# Altium schematic sheet BAT.SchDoc
size A
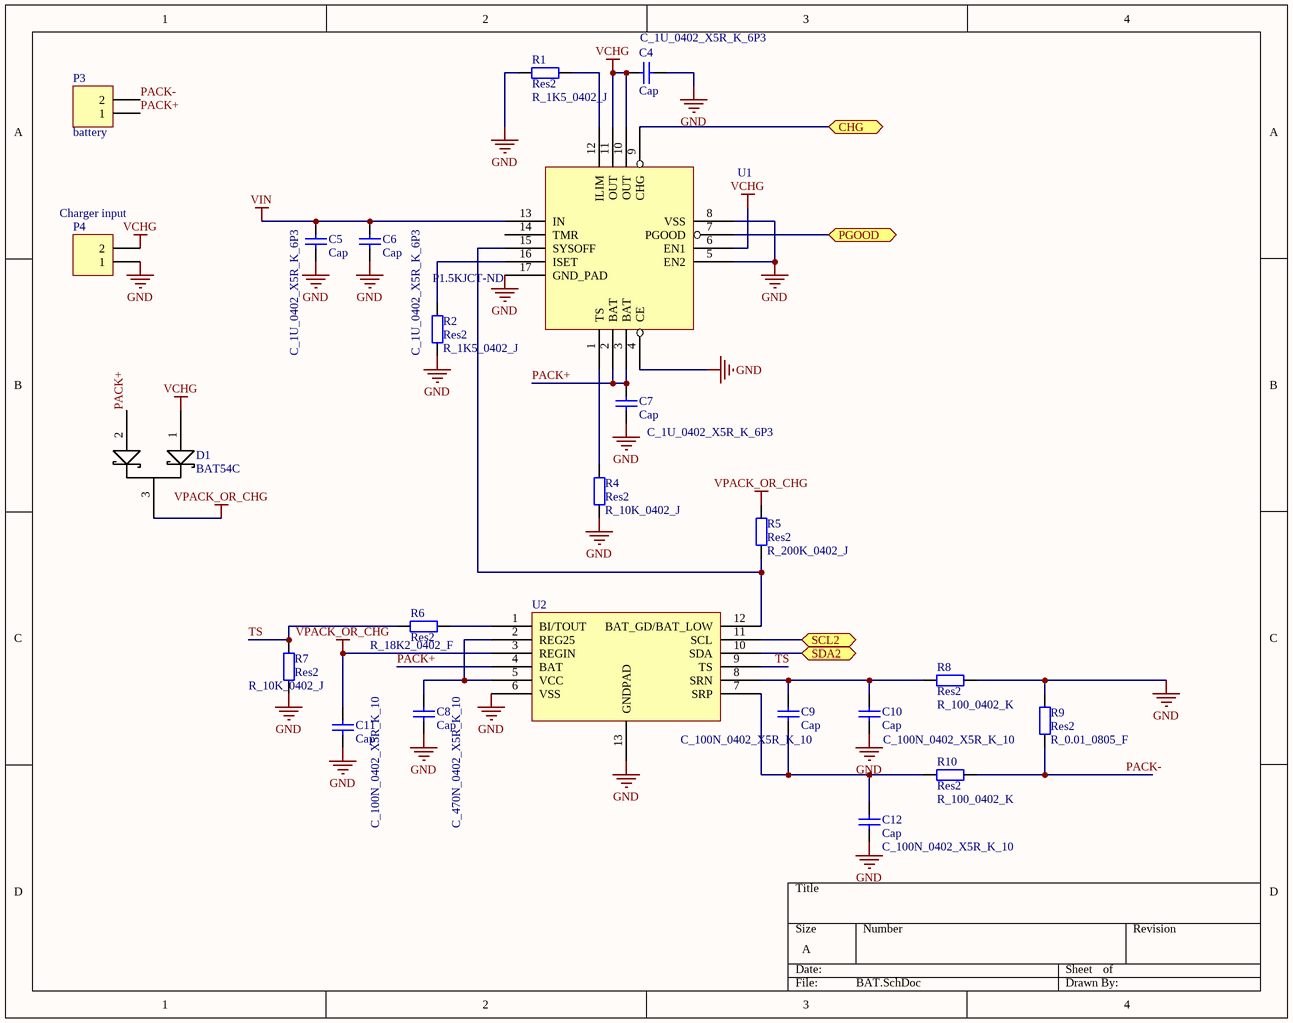
[diagram p0: BAT.SchDoc]

## Parts
C4  Cap  value C_1U_0402_X5R_K_6P3  [C_0402]
C5  Cap  value C_1U_0402_X5R_K_6P3  [C_0402]
C6  Cap  value C_1U_0402_X5R_K_6P3  [C_0402]
C7  Cap  value C_1U_0402_X5R_K_6P3  [C_0402]
C8  Cap  value C_470N_0402_X5R_K_10  [C_0402]
C9  Cap  value C_100N_0402_X5R_K_10  [C_0402]
C10  Cap  value C_100N_0402_X5R_K_10  [C_0402]
C11  Cap  value C_100N_0402_X5R_K_10  [C_0402]
C12  Cap  value C_100N_0402_X5R_K_10  [C_0402]
D1  BAT54C  [SOT-23_N]
P3  battery  [PL-041939]
P4  Charger input  [HDR1X2]
R1  Res2  value R_1K5_0402_J  [R_0402]
R2  Res2  value R_1K5_0402_J  Supplier Part Number 1: P1.5KJCT-ND  [R_0402]
R4  Res2  value R_10K_0402_J  [R_0402]
R5  Res2  value R_200K_0402_J  [R_0402]
R6  Res2  value R_18K2_0402_F  [R_0402]
R7  Res2  value R_10K_0402_J  [R_0402]
R8  Res2  value R_100_0402_K  [R_0402]
R9  Res2  value R_0.01_0805_F  [R_0805]
R10  Res2  value R_100_0402_K  [R_0402]
U1  BQ24079TRGTR  [S-PVQFN-N16]  (value not drawn)
U2  BQ27510DRZR-G2  [S-PDSO-N12]  (value not drawn)

## Ports
CHG, PGOOD, SCL2, SDA2

## Nets
GND: C4.1 C5.1 C6.1 C7.1 C8.1 C10.1 C11.1 C12.1 P4.1 R1.1 R2.2 R4.1 R7.1 R8.2 R9.2 U1.4(CE) U1.5(EN2) U1.8(VSS) U1.17(GND_PAD) U2.6(VSS) U2.13(GNDPAD)
VCHG: C4.2 D1.1 P4.2 U1.6(EN1) U1.10(OUT) U1.11(OUT)
VIN: C5.2 C6.2 U1.13(IN)
VPACK_OR_CHG: C11.2 D1.3 R5.1 U2.3(REGIN)
CHG: U1.9(CHG) ; port CHG
PACK+: C7.2 D1.2 P3.1 U1.2(BAT) U1.3(BAT) U2.4(BAT)
PACK-: P3.2 R9.1 R10.2
PGOOD: U1.7(PGOOD) ; port PGOOD
SCL2: U2.11(SCL) ; port SCL2
SDA2: U2.10(SDA) ; port SDA2
TS: R6.1 R7.2 U2.9(TS)
NetC8_2: C8.2 U2.2(REG25) U2.5(VCC)
NetC9_1: C9.1 C12.2 R10.1 U2.7(SRP)
NetC9_2: C9.2 C10.2 R8.1 U2.8(SRN)
NetR1_2: R1.2 U1.12(ILIM)
NetR2_1: R2.1 U1.16(ISET)
NetR4_2: R4.2 U1.1(TS)
NetR5_2: R5.2 U1.15(SYSOFF) U2.12(BAT_GD/BAT_LOW)
NetR6_2: R6.2 U2.1(BI/TOUT)

Not connected (* = marked no-connect by the designer): U1 14(TMR)

## Library data of the parts
C4-C12 = Cap: Capacitor; Published: 8-Jun-2000; LatestRevisionDate: 17-Jul-2002; LatestRevisionNote: Re-released for DXP Platform.; Publisher: Altium Limited; Supplier 1: Digi-Key; Supplier 2: Mouser
  C4-C7: Supplier Part Number 1: 490-1320-1-ND; Supplier Part Number 2: 81-GRM155R60J105KE19
  C8: Supplier Part Number 1: 490-3264-1-ND; Supplier Part Number 2: 81-GRM155R61A474KE5D
  C9-C12: Supplier Part Number 1: 490-1318-6-ND; Supplier Part Number 2: 81-GRM155R61A104KA01
D1 = BAT54C: FAIRCHILD SEMICONDUCTOR - BAT54C - SCHOTTKY RECTIFIER, CMN CTHD 0.2A SOT-23; Diode Configuration: Common Cathode; Repetitive Reverse Voltage Vrrm Max: 30; Forward Current If(AV): 200; Forward Voltage VF Max: 800; Reverse Recovery Time trr Max: 5; Manufacturer: FAIRCHILD SEMICONDUCTOR; Manufacturer Part Number: BAT54C; RoHS: YES; Stock 1: 19500; Pricing 1: 1=0.037, 25=0.033, 100=0.033, 250=0.028, 500=0.025, 1000=0.024 (USD); Diode Type: Schottky; ComponentLink1URL: http://www.fairchildsemi.com/ds/BA/BAT54C.pdf; ComponentLink1Description: http://www.fairchildsemi.com/ds/BA/BAT54C.pdf; Supplier 1: Digi-Key; Supplier Part Number 1: BAT54C-V-GS08GIDKR-ND; Supplier 2: Mouser; Supplier Part Number 2: 512-BAT54C
P3 = Header 2: Header, 2-Pin; LatestRevisionDate: 17-Jul-2002; LatestRevisionNote: Re-released for DXP Platform.; Publisher: Altium Limited
P4 = Header 2: SM Battery Holder 1/2 AA; LatestRevisionDate: 17-Jul-2002; LatestRevisionNote: Re-released for DXP Platform.; Publisher: Altium Limited; Supplier 1: Digi-Key; Supplier Part Number 1: 1016K-ND; Supplier 2: Newark; Supplier Part Number 2: 57R3956
R1 R2 R4-R8 R10 = Res2: Resistor; Published: 8-Jun-2000; LatestRevisionDate: 17-Jul-2002; LatestRevisionNote: Re-released for DXP Platform.; PackageReference: AXIAL-0.4; Publisher: Altium Limited; PackageDescription: Axial Device, Thru-Hole; 2 Leads; 0.4 in Pin Spacing; Supplier 1: Digi-Key
  R1: Supplier Part Number 1: P1.5KJCT-ND
  R4 R7: Supplier Part Number 1: P10KJCT-ND; Supplier 2: Mouser; Supplier Part Number 2: 667-ERJ-2GEJ103X
  R5: Supplier Part Number 1: P200KJCT-ND
  R6: Supplier Part Number 1: P18.2KLCT-ND; Supplier 2: Mouser; Supplier Part Number 2: 667-ERJ-2RKF1822X
  R8 R10: Supplier Part Number 1: P100GCT-ND; Supplier 2: Mouser; Supplier Part Number 2: 667-ERJ-3GEYJ101V
R9 = Res2: Resistor; Manufacturer: Panasonic Electronic Components; Manufacturer Part Number: ERJ-6BWFR010V; Description: Thick Film Resistors - SMD 0805 0.010ohms 1% Tol; Power Rating: 250 mWatts (1/4 Watt); Resistance: 10 mOhms; Temperature Coefficient: 300 PPM / C; Tolerance: 5 %; Product Status: New at Mouser; Published: 8-Jun-2000; LatestRevisionDate: 17-Jul-2002; LatestRevisionNote: Re-released for DXP Platform.; Publisher: Altium Limited; Supplier 1: Digi-Key; Supplier Part Number 1: P.01AQCT-ND; Supplier 2: Mouser; Supplier Part Number 2: 667-ERJ-6BWFR010V; RoHS: RoHS Compliant By Exemption; Category: Thick Film Resistors - SMD; Stock 2: 2239; Pricing 2: 1=1.04, 25=0.772, 100=0.709, 250=0.626, 500=0.521, 1000=0.406, 2000=0.337, 5000=0.269, 10000=0.261 (USD); Dimensions: 1.2 mm W x 2 mm L x 0.6 mm H; Operating Temperature Range: - 55 C to + 155 C; Package / Case: 0805 (2012 metric); Packaging: Reel; Product: Thick Film Resistors SMD; Series: ERJ; Termination Style: SMD/SMT; Product Category: .; RoHS - Mouser: E; Minimum Order Quantity: 1; Reeling: True; ComponentLink1URL: http://industrial.panasonic.com/www-data/pdf/AOA0000/AOA0000CE3.pdf; ComponentLink1Description: http://industrial.panasonic.com/www-data/pdf/AOA0000/AOA0000CE3.pdf
U1 = BQ24079TRGTR: IC LI-ION CHARGE/PWR MGMT 16QFN; Manufacturer: Texas Instruments; Function: Charge Management; Battery Chemistry: Lithium-Ion (Li-Ion); Voltage - Supply: 4.35 V ~ 26 V; Supplier 1: Digi-Key; Manufacturer Part Number: BQ24079TRGTR; RoHS: RoHS Compliant; Category: Integrated Circuits (ICs); Stock 1: 2351; Pricing 1: 1=2.88, 10=2.58, 25=2.32, 100=2.11, 250=1.91, 500=1.71, 1000=1.44 (USD); Operating Temperature: -40°C ~ 85°C; Mounting Type: Surface Mount; Package / Case: 16-VFQFN Exposed Pad; Supplier Device Package: 16-QFN-EP (3x3); Packaging: Cut Tape (CT); ComponentLink1URL: http://www.ti.com/lit/ds/symlink/bq24075t.pdf; ComponentLink1Description: http://www.ti.com/lit/ds/symlink/bq24075t.pdf; Supplier Part Number 1: 296-25610-1-ND
U2 = BQ27510DRZR-G2: IC BATT FUEL GAUGE LI-ION 12SON; Manufacturer: Texas Instruments; Function: Fuel, Gas Gauge/Monitor; Battery Chemistry: Lithium-Ion (Li-Ion); Voltage - Supply: 2.7 V ~ 5.5 V; Supplier 1: Digi-Key; Manufacturer Part Number: BQ27510DRZR-G2; RoHS: RoHS Compliant; Category: Integrated Circuits (ICs); Stock 1: 1001; Pricing 1: 1=4.18, 10=3.741, 25=3.364, 100=3.0595, 250=2.76952, 500=2.4795, 1000=2.088 (USD); Operating Temperature: -40°C ~ 85°C; Mounting Type: Surface Mount; Package / Case: 12-VFDFN Exposed Pad; Supplier Device Package: 12-SON Exposed Pad (2.5x4); Packaging: Cut Tape (CT); ComponentLink1URL: http://www.ti.com/lit/ds/symlink/bq27510-g2.pdf; ComponentLink1Description: http://www.ti.com/lit/ds/symlink/bq27510-g2.pdf; Supplier 2: Mouser; Supplier Part Number 1: 296-27728-1-ND; Supplier Part Number 2: 595-BQ27510DRZT-G2